# EAGLE design rangkaian_score_foul (EAGLE 9.5.1)
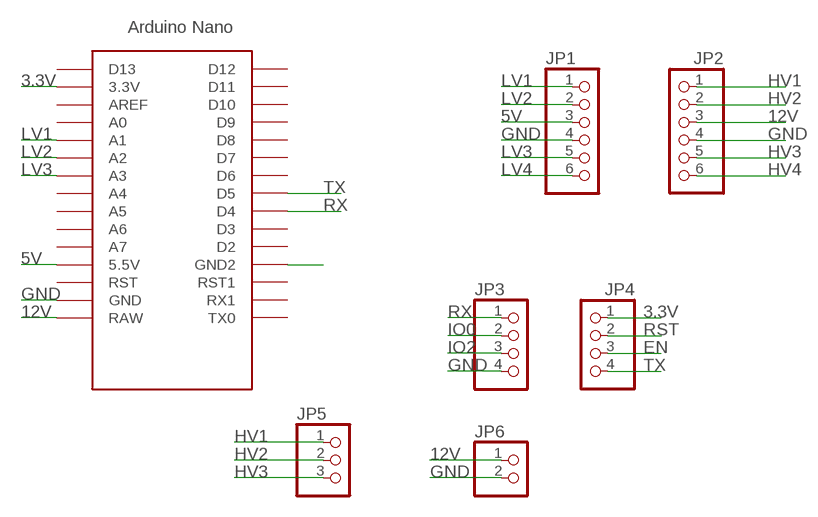
[diagram p0: schematic, sheet 1]

## Parts
JP1  PINHD-1X6  [1X06]
JP2  PINHD-1X6  [1X06]
JP3  PINHD-1X4  [1X04]
JP4  PINHD-1X4  [1X04]
JP5  PINHD-1X3  [1X03]
JP6  PINHD-1X2  [1X02]
U$1  NANO  [NANO]

## Nets
3.3V: JP4.1 U$1.3.3V
5V: JP1.3 U$1.5V(5.5V)
12V: JP2.3 JP6.1 U$1.RAW
EN: JP4.3
GND: JP1.4 JP2.4 JP3.4 JP6.2 U$1.GND
HV1: JP2.1 JP5.1
HV2: JP2.2 JP5.2
HV3: JP2.5 JP5.3
HV4: JP2.6
IO0: JP3.2
IO2: JP3.3
LV1: JP1.1 U$1.A1
LV2: JP1.2 U$1.A2
LV3: JP1.5 U$1.A3
LV4: JP1.6
N$6: U$1.GND1(GND2)
RST: JP4.2
RX: JP3.1 U$1.D4
TX: JP4.4 U$1.D5
Unconnected: U$1.A0 U$1.A4 U$1.A5 U$1.A6 U$1.A7 U$1.AREF U$1.D2 U$1.D3 U$1.D6 U$1.D7 U$1.D8 U$1.D9 U$1.D10 U$1.D11 U$1.D12 U$1.D13 U$1.ICSP1 U$1.ICSP2 U$1.ICSP3 U$1.ICSP4 U$1.ICSP5 U$1.ICSP6 U$1.RST U$1.RST1 U$1.RX1 U$1.TX0

## Library data of the parts
JP1 JP2 = pinhead:PINHD-1X6: PIN HEADER
JP3 JP4 = pinhead:PINHD-1X4: PIN HEADER
JP5 = pinhead:PINHD-1X3: PIN HEADER
JP6 = pinhead:PINHD-1X2: PIN HEADER
U$1 = Arduino-clone:NANO: Arduino Nano

## Board
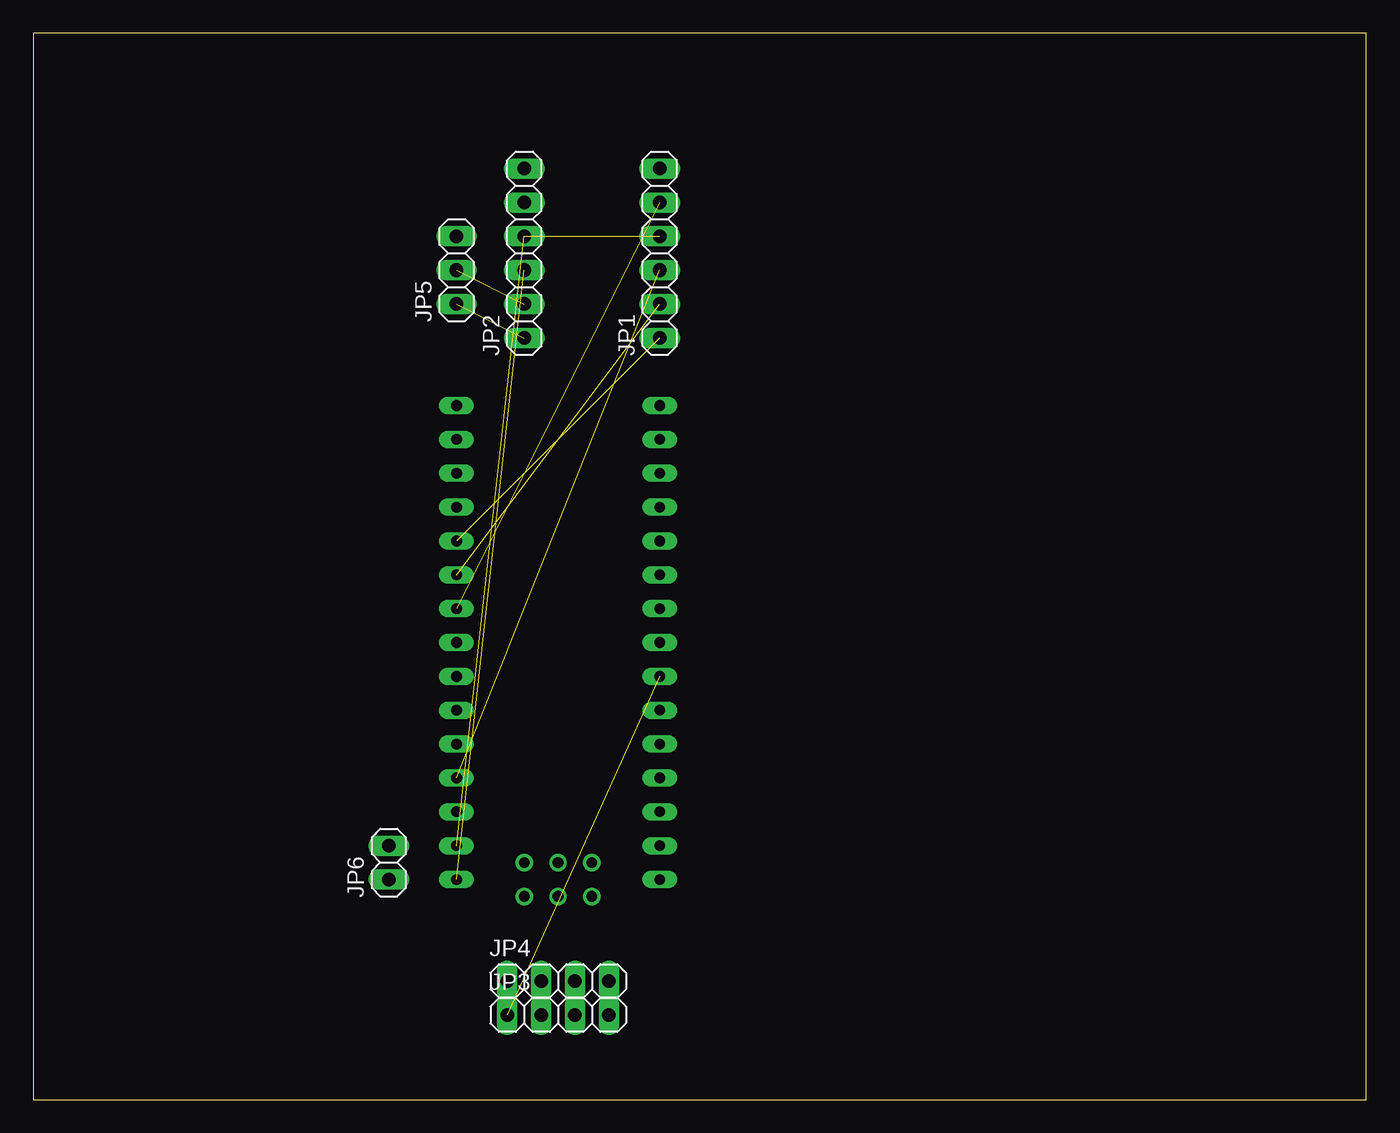
[diagram p1: board, top side]
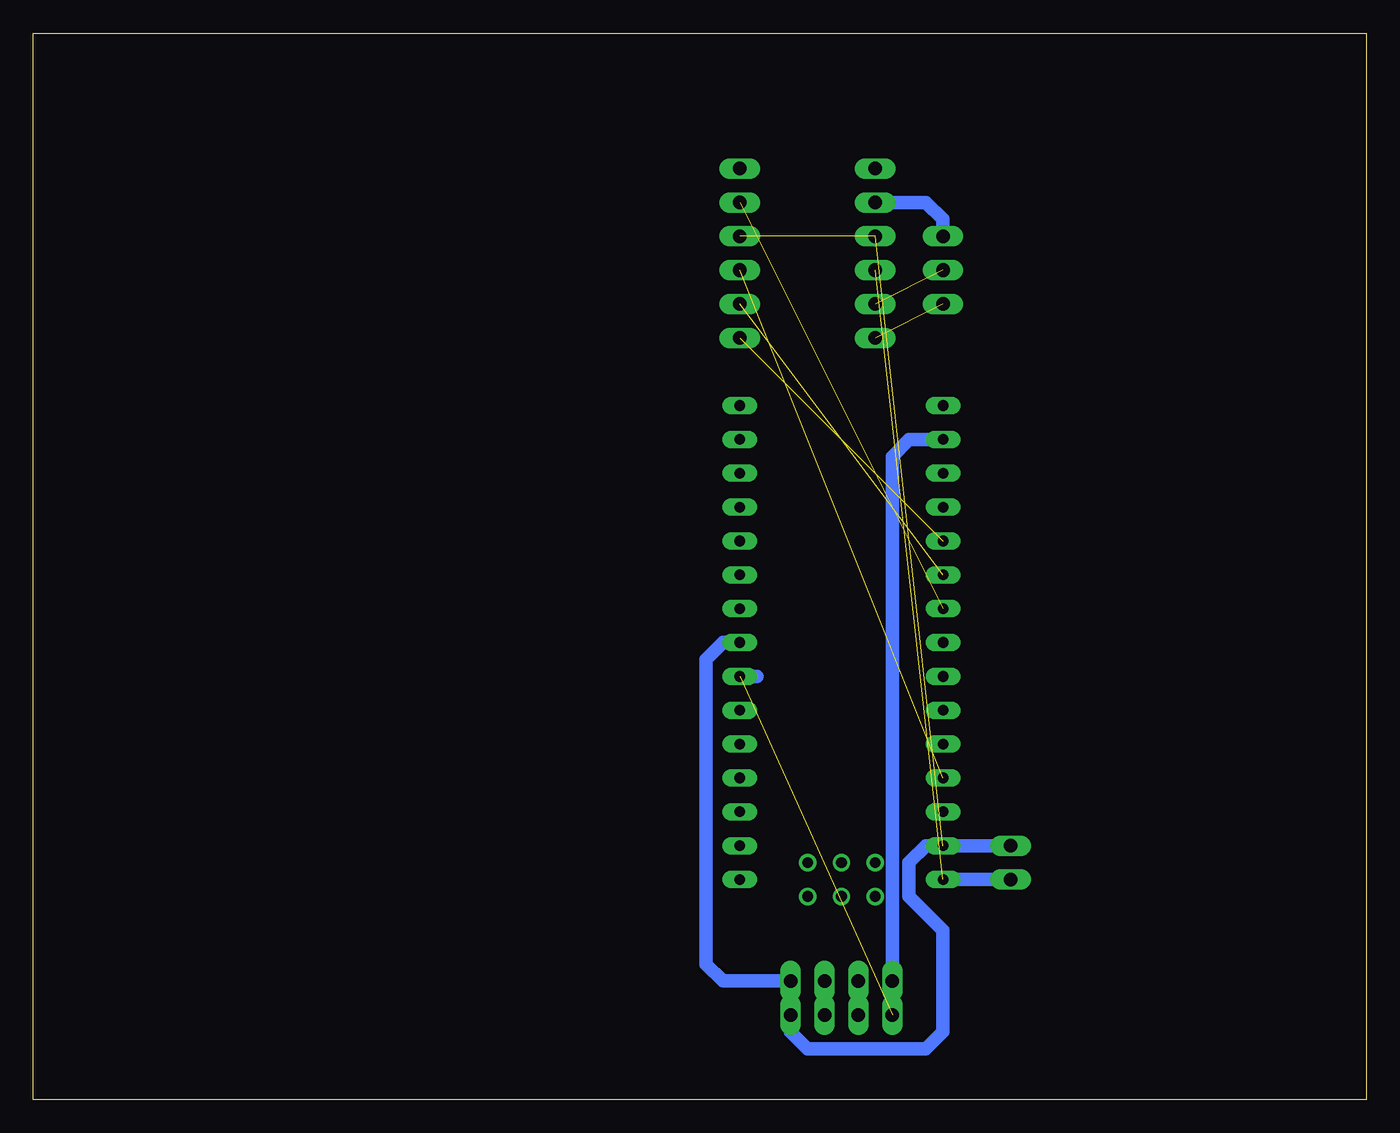
[diagram p2: board, bottom side, seen from below]

Size 100 x 80 mm. Coordinates in mm from the lower left corner, seen from the top.
Outline: 0,0 100,0 100,80 0,80 0,0
Copper layers (1*16): Top 0.035mm / dielectric 1.5mm / Bottom 0.035mm
Design rules "default": minimum track width 6mil, minimum drill 0.35mm, track to track 6mil, track to pad 6mil, pad to pad 6mil, via to via 6mil, smd to smd 6mil, copper to edge 40mil, drill to drill 6mil, minimum pad ring 10mil, minimum via ring 8mil, stop-mask expansion 4mil, vias tented up to drill 0mil, thermal gap 10mil

### Footprints (pad centres in the part's own frame; a part is rotated, then mirrored left to right if it is on the bottom)
1X06 = drill 1.016 long: 1 -6.35,0; 2 -3.81,0; 3 -1.27,0; 4 1.27,0; 5 3.81,0; 6 6.35,0
1X04 = drill 1.016 long: 1 -3.81,0; 2 -1.27,0; 3 1.27,0; 4 3.81,0
1X03 = drill 1.016 long: 1 -2.54,0; 2 0,0; 3 2.54,0
1X02 = drill 1.016 long: 1 -1.27,0; 2 1.27,0
NANO = drill 0.8 long: 3.3V -10.16,24.13; 5V -10.16,-1.27; A0 -10.16,19.05; A1 -10.16,16.51; A2 -10.16,13.97; A3 -10.16,11.43; A4 -10.16,8.89; A5 -10.16,6.35; A6 -10.16,3.81; A7 -10.16,1.27; AREF -10.16,21.59; D2 5.08,1.27; D3 5.08,3.81; D4 5.08,6.35; D5 5.08,8.89; D6 5.08,11.43; D7 5.08,13.97; D8 5.08,16.51; D9 5.08,19.05; D10 5.08,21.59; D11 5.08,24.13; D12 5.08,26.67; D13 -10.16,26.67; GND -10.16,-6.35; GND1 5.08,-1.27; RAW -10.16,-8.89; RST -10.16,-3.81; RST1 5.08,-3.81; RX1 5.08,-6.35; TX0 5.08,-8.89 | drill 0.8: ICSP1 -5.08,-10.16; ICSP2 -5.08,-7.62; ICSP3 -2.54,-10.16; ICSP4 -2.54,-7.62; ICSP5 0,-10.16; ICSP6 0,-7.62

### Placement (x,y rotation side)
JP1  46.99,63.5 90 top
JP2  36.83,63.5 90 top
JP3  39.37,6.35 0 top
JP4  39.37,8.89 0 top
JP5  31.75,62.23 90 top
JP6  26.67,17.78 90 top
U$1  41.91,25.4 0 top

### Tracks (layer width: path | path; a pad name or v marks a point on that pad's centre or on a via)
3.3V
  Bottom 1.016: JP4.1 35.56,48.26 34.29,49.53 U$1.3.3V
5V  (1 unrouted)
12V  (1 unrouted)
  Bottom 1.016: JP6.1 U$1.RAW
GND  (2 unrouted)
  Bottom 1.016: JP3.4 43.18,5.08 41.91,3.81 33.02,3.81 31.75,5.08 31.75,12.7 34.29,15.24 34.29,17.78 33.02,19.05 U$1.GND JP6.2
HV1  (1 unrouted)
HV2  (1 unrouted)
HV3
  Bottom 1.016: JP5.3 31.75,66.04 33.02,67.31 JP2.5
LV1  (1 unrouted)
LV2  (1 unrouted)
LV3  (1 unrouted)
RX  (1 unrouted)
  Bottom 1.016: U$1.D4 45.72,31.75
TX
  Bottom 1.016: U$1.D5 48.26,34.29 49.53,33.02 49.53,10.16 48.26,8.89 JP4.4